# Altium schematic sheet H01R0_Frontend.SchDoc
size Letter; CompanyName: Hexabitz; DocumentNumber: 3; SheetNumber: 2; SheetTotal: 2
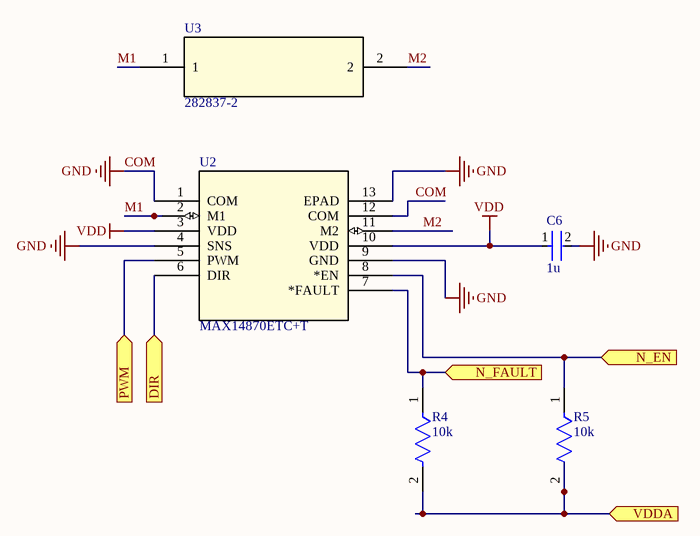
[diagram p0: H01R0_Frontend.SchDoc]

## Parts
C6  1u  [FP-0603-L_1_6_0_15-W_0_8-IPC_C]
R4  10k  [FP-SG73P1J-MFG]
R5  10k  [FP-SG73P1J-MFG]
U2  MAX14870ETC+T  [21-0664B_MXM]
U3  282837-2  [282837-2_TYC]

## Ports
  N_FAULT (in), DIR (in), N_EN (in), PWM (in), VDDA (in)

## Nets
COM: C6.2 U2.1(COM) U2.4(SNS) U2.9(GND) U2.12(COM) U2.13(EPAD)  [also labelled  GND, GND]
VDD: C6.1 U2.3(VDD) U2.10(VDD)
  N_FAULT: R4.1 U2.7(*FAULT) ; port   N_FAULT
DIR: U2.6(DIR) ; port DIR
M1: U2.2(M1) U3.1
M2: U2.11(M2) U3.2
N_EN: R5.1 U2.8(*EN) ; port N_EN
PWM: U2.5(PWM) ; port PWM
VDDA: R4.2 R5.2 ; port VDDA

## Notes on the sheet
- Module:
- Title:
- Description:
- Size:
- Revision:
- Letter
- www.hexabitz.com
- Date:
- Time:
- Sheet
- of

## Library data of the parts
C6 = CMP-2000-07531-4: Ceramic Capacitor General Use 1uF ±10% 50V X7R 0603; Series: M; Width: 0.031inch; Mount: Surface Mount; Radiation Hardening: No; Voltage Rating (DC): 50V; Packaging: Tape and Reel; Termination: SMD/SMT; Depth: 0.8mm; Case Code (Metric): 1608; Case Code (Imperial): 0603; Height: 0.8mm; Voltage Rating: 50V; Package Quantity: 1; Halogen Free: Halogen Free; Dielectric: X7R; Min Operating Temperature: -55°C; Length: 1.6mm; Construction: Flat; Tolerance: 10%; Thickness: 0.037inch; Max Operating Temperature: 125°C; Case/Package: 0603; Capacitance: 1uF; RoHS Compliant: Yes
R4 R5 = CMP-00683-07748074-1: SG73P1JTTD1002F Res Thick Film 0603 10K Ohm 1% 0.2W(1/5W) ±100ppm/C Pad SMD Automotive T/R; Temperature Coefficient: 100ppm/°C; Power Rating: 200mW; Voltage Rating (DC): 50V; Resistance: 10kΩ; Case/Package: 0603; RoHS: Compliant; Termination: SMD/SMT; Case Code (Metric): 1608; Min Operating Temperature: -55°C; Voltage Rating: 50V; NexarPartId: 7748074; Tolerance: 1%; Case Code (Imperial): 0603; Max Operating Temperature: 155°C; Number of Pins: 2
U2 = MAX14870ETC+T: Compact 4.5V to 36V Full-Bridge DC Motor Drivers; Manufacturer_Name: Analog Devices / Maxim Integrated; Copyright: Copyright (C) 2025 Ultra Librarian. All rights reserved.; Manufacturer_Part_Number: MAX14870ETC+T; RefDes: RefDes; Type: Type
U3 = CMP-007-000000-1: TERMI-BLOK PCB MOUNT 2P; Manufacturer_Name: TE Connectivity; Manufacturer_Part_Number: 282837-2; Copyright: Copyright (C) 2025 Ultra Librarian. All rights reserved.; RefDes: RefDes; Type: Type; Design Item ID: 282837-2; Source: 282837-2.SchLib